# Altium schematic sheet Interface.SchDoc
size Legal
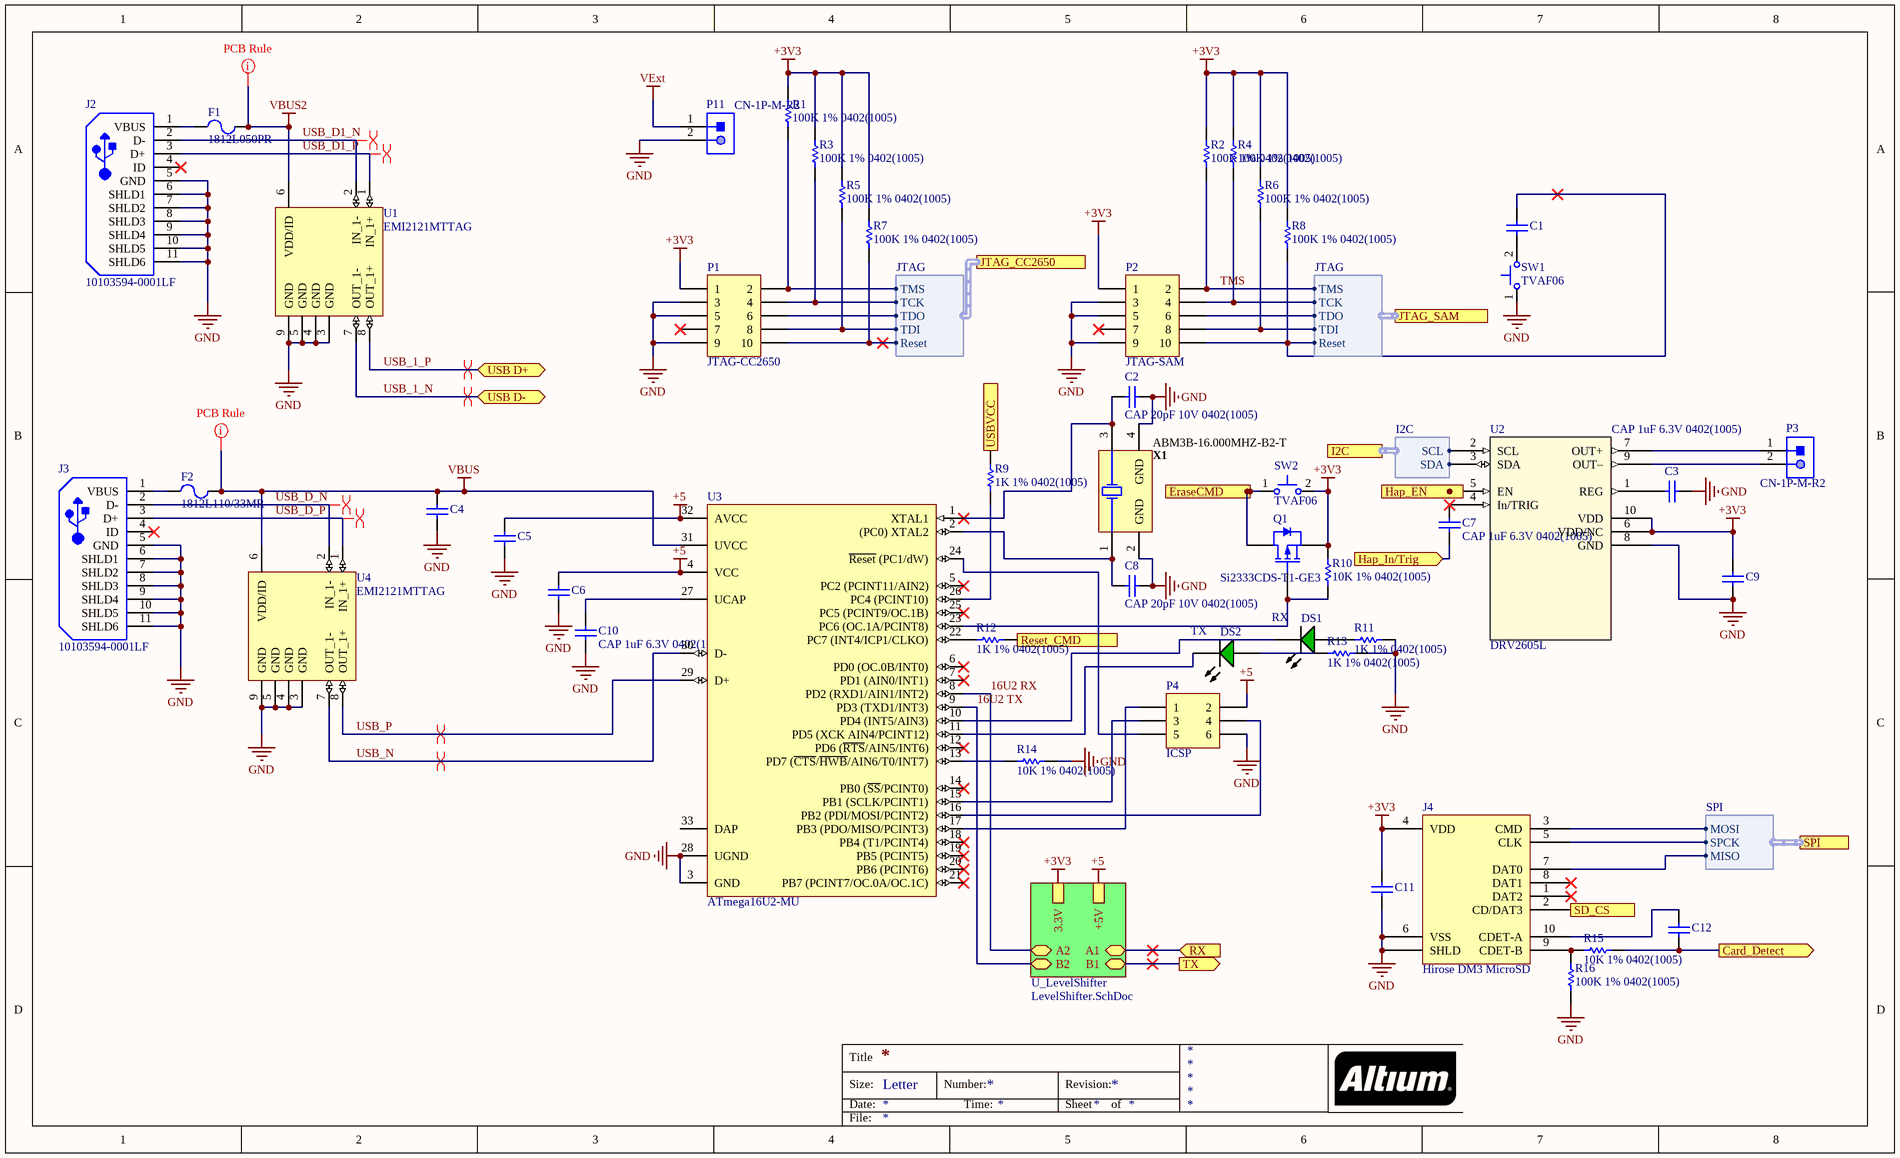
[diagram p0: Interface.SchDoc]

## Parts
C1  CAP 100nF 10V 0402(1005)  [CAPC0402(1005)60_L]  (value not drawn)
C2  CAP 20pF 10V 0402(1005)  [CAPC0402(1005)60_L]
C3  CAP 1uF 6.3V 0402(1005)  [CAPC0402(1005)60_L]
C4  CAP 100nF 10V 0402(1005)  [CAPC0402(1005)60_L]  (value not drawn)
C5  CAP 100nF 10V 0402(1005)  [CAPC0402(1005)60_L]  (value not drawn)
C6  CAP 100nF 10V 0402(1005)  [CAPC0402(1005)60_L]  (value not drawn)
C7  CAP 1uF 6.3V 0402(1005)  [CAPC0402(1005)60_L]
C8  CAP 20pF 10V 0402(1005)  [CAPC0402(1005)60_L]
C9  CAP 100nF 10V 0402(1005)  [CAPC0402(1005)60_L]  (value not drawn)
C10  CAP 1uF 6.3V 0402(1005)  [CAPC0402(1005)60_L]
C11  CAP 100nF 10V 0402(1005)  [CAPC0402(1005)60_L]  (value not drawn)
C12  CAP 100nF 10V 0402(1005)  [CAPC0402(1005)60_L]  (value not drawn)
DS1  RX  [LTST-C190GKT_V]
DS2  TX  [LTST-C190GKT_V]
F1  1812L050PR  [LFUS-1812L050_V]
F2  1812L110/33MR  [LFUS-1812L11033MR_V]
J2  10103594-0001LF  [FCI-10103594-0001LF_V]
J3  10103594-0001LF  [FCI-10103594-0001LF_V]
J4  Hirose DM3 MicroSD  [HIROSE DM3AT-SF-PEJM5]
P1  JTAG-CC2650  [MHDR2X5]
P2  JTAG-SAM  [MHDR2X5]
P3  CN-1P-M-R2  [B2B-PH-K-S]
P4  ICSP  [MHDR2X3]
P11  CN-1P-M-R2  [B2B-PH-K-S]
Q1  Si2333CDS-T1-GE3  [DIOD-SOT23-3_V]
R1  100K 1% 0402(1005)  [RESC0402(1005)_L]
R2  100K 1% 0402(1005)  [RESC0402(1005)_L]
R3  100K 1% 0402(1005)  [RESC0402(1005)_L]
R4  100K 1% 0402(1005)  [RESC0402(1005)_L]
R5  100K 1% 0402(1005)  [RESC0402(1005)_L]
R6  100K 1% 0402(1005)  [RESC0402(1005)_L]
R7  100K 1% 0402(1005)  [RESC0402(1005)_L]
R8  100K 1% 0402(1005)  [RESC0402(1005)_L]
R9  1K 1% 0402(1005)  [RESC0402(1005)_L]
R10  10K 1% 0402(1005)  [RESC0402(1005)_L]
R11  1K 1% 0402(1005)  [RESC0402(1005)_L]
R12  1K 1% 0402(1005)  [RESC0402(1005)_L]
R13  1K 1% 0402(1005)  [RESC0402(1005)_L]
R14  10K 1% 0402(1005)  [RESC0402(1005)_L]
R15  10K 1% 0402(1005)  [RESC0402(1005)_L]
R16  100K 1% 0402(1005)  [RESC0402(1005)_L]
SW1  TVAF06  [JNFU-TVAF06_V]
SW2  TVAF06  [JNFU-TVAF06_V]
U1  EMI2121MTTAG  [ONSC-WDFN-8-511BN_V]
U2  DRV2605L  [TSSOP50P490X110-10N]
U3  ATmega16U2-MU  [32PG_N]
U4  EMI2121MTTAG  [ONSC-WDFN-8-511BN_V]
X1  ABM3B-16.000MHZ-B2-T  [ABRA-ABM3B-4_V]

## Sub-sheets
U_LevelShifter = LevelShifter.SchDoc: 3.3V, A1 (bidir), A2 (bidir), +5V, B2 (bidir), B1 (bidir)

## Ports
Card_Detect (out), EraseCMD (out), Hap_EN (in), Hap_In/Trig (in), I2C (harness I2C), JTAG_CC2650 (harness JTAG), JTAG_SAM (harness JTAG), Reset_CMD (out), RX (in), SD_CS (in), SPI (harness SPI), TX (out), USB D+ (bidir), USB D- (bidir), USBVCC

## Harnesses
SPI: MISO, MOSI, SPCK
JTAG: TMS, TCK, TDO, TDI, Reset
I2C: SCL, SDA

## Nets
+3V3: C9.1 C11.2 J4.4(VDD) P1.1 P2.1 Q1.2(S) R1.2 R2.2 R3.2 R4.2 R5.2 R6.2 R7.2 R8.2 R10.2 SW2.2 U2.6(VDD/NC) U2.10(VDD) ; sheet U_LevelShifter/3.3V
+5: C5.1 C6.1 P4.2 U3.4(VCC) U3.32(AVCC) ; sheet U_LevelShifter/+5V
GND: C2.2 C3.1 C4.2 C5.2 C6.2 C8.2 C9.2 C10.1 C11.1 J2.5(GND) J2.6(SHLD1) J2.7(SHLD2) J2.8(SHLD3) J2.9(SHLD4) J2.10(SHLD5) J2.11(SHLD6) J3.5(GND) J3.6(SHLD1) J3.7(SHLD2) J3.8(SHLD3) J3.9(SHLD4) J3.10(SHLD5) J3.11(SHLD6) J4.6(VSS) J4.S(SHLD) P1.3 P1.5 P1.9 P2.3 P2.5 P2.9 P4.6 P11.2 R11.2 R13.2 R14.2 R16.2 SW1.1 U1.3(GND) U1.4(GND) U1.5(GND) U1.9(GND) U2.8(GND) U3.3(GND) U3.28(UGND) U4.3(GND) U4.4(GND) U4.5(GND) U4.9(GND) X1.2(GND) X1.4(GND)
VBUS: C4.1 F2.2 U3.31(UVCC) U4.6(VDD/ID)
VBUS2: F1.2 U1.6(VDD/ID)
VExt: P11.1
16U2 RX: U3.8(PD2_(RXD1/AIN1/INT2)) ; sheet U_LevelShifter/A2
16U2 TX: U3.9(PD3_(TXD1/INT3)) ; sheet U_LevelShifter/B2
Card_Detect: C12.1 R15.2 ; port Card_Detect
EraseCMD: Q1.3(D) SW2.1 ; port EraseCMD
Hap_In/Trig: C7.2 ; port Hap_In/Trig
Reset_CMD: R12.2 ; port Reset_CMD
RX: port RX, sheet U_LevelShifter/A1
SD_CS: J4.2(CD/DAT3) ; port SD_CS
TMS: P2.2 R2.1 ; port JTAG_SAM.TMS
TX: port TX, sheet U_LevelShifter/B1
USB_1_N: U1.7(OUT_1-) ; port USB D-
USB_1_P: U1.8(OUT_1+) ; port USB D+
USB_D1_N: J2.2(D-) U1.2(IN_1-)
USB_D1_P: J2.3(D+) U1.1(IN_1+)
USB_D_N: J3.2(D-) U4.2(IN_1-)
USB_D_P: J3.3(D+) U4.1(IN_1+)
USB_N: U3.30(D-) U4.7(OUT_1-)
USB_P: U3.29(D+) U4.8(OUT_1+)
USBVCC: R9.2 ; port USBVCC
NetC1_1: C1.1 SW1.2
NetC1_2: C1.2 P2.10 R8.1 ; port JTAG_SAM.Reset
NetC2_1: C2.1 U3.1(XTAL1) X1.3(X2)
NetC3_2: C3.2 U2.1(REG)
NetC7_1: C7.1 U2.4(In/TRIG)
NetC8_1: C8.1 U3.2((PC0)_XTAL2) X1.1(X1)
NetC10_2: C10.2 U3.27(UCAP)
NetC12_2: C12.2 J4.10(CDET-A)
NetDS1_1: DS1.1(A) R11.1
NetDS1_2: DS1.2(K) U3.10(PD4_(INT5/AIN3))
NetDS2_1: DS2.1(A) R13.1
NetDS2_2: DS2.2(K) U3.11(PD5_(XCK_AIN4/PCINT12))
NetF1_1: F1.1 J2.1(VBUS)
NetF2_1: F2.1 J3.1(VBUS)
NetJ4_3: J4.3(CMD) ; port SPI.MOSI
NetJ4_5: J4.5(CLK) ; port SPI.SPCK
NetJ4_7: J4.7(DAT0) ; port SPI.MISO
NetJ4_9: J4.9(CDET-B) R15.1 R16.1
NetP1_2: P1.2 R1.1 ; port JTAG_CC2650.TMS
NetP1_4: P1.4 R3.1 ; port JTAG_CC2650.TCK
NetP1_6: P1.6 ; port JTAG_CC2650.TDO
NetP1_8: P1.8 R5.1 ; port JTAG_CC2650.TDI
NetP1_10: P1.10 R7.1 ; port JTAG_CC2650.Reset
NetP2_4: P2.4 R4.1 ; port JTAG_SAM.TCK
NetP2_6: P2.6 ; port JTAG_SAM.TDO
NetP2_8: P2.8 R6.1 ; port JTAG_SAM.TDI
NetP3_1: P3.1 U2.7(OUT+)
NetP3_2: P3.2 U2.9(OUT–)
NetP4_1: P4.1 U3.17(PB3_(PDO/MISO/PCINT3))
NetP4_3: P4.3 U3.15(PB1_(SCLK/PCINT1))
NetP4_4: P4.4 U3.16(PB2_(PDI/MOSI/PCINT2))
NetP4_5: P4.5 U3.24(~{Reset}_(PC1/dW))
NetQ1_1: Q1.1(G) R10.1 U3.23(PC6_(OC.1A/PCINT8))
NetR9_1: R9.1 U3.26(PC4_(PCINT10))
NetR12_1: R12.1 U3.22(PC7_(INT4/ICP1/CLKO))
NetR14_1: R14.1 U3.13(PD7_(~{CTS}/~{HWB}/AIN6/T0/INT7))
NetU2_2: U2.2(SCL) ; port I2C.SCL
NetU2_3: U2.3(SDA) ; port I2C.SDA

Not connected (* = marked no-connect by the designer): J2 4(ID)*; J3 4(ID)*; J4 1(DAT2)* 8(DAT1)*; P1 7*; P2 7*; U2 5(EN); U3 5(PC2_(PCINT11/AIN2))* 6(PD0_(OC.0B/INT0))* 7(PD1_(AIN0/INT1))* 12(PD6_(~{RTS}/AIN5/INT6))* 14(PB0_(~{SS}/PCINT0))* 18(PB4_(T1/PCINT4))* 19(PB5_(PCINT5))* 20(PB6_(PCINT6))* 21(PB7_(PCINT7/OC.0A/OC.1C))* 25(PC5_(PCINT9/OC.1B))* 33(DAP)

## Layout directives
differential pair: USB_1_N, USB_1_P, USB_D1_N, USB_D1_P, USB_D_N, USB_D_P, USB_N, USB_P
rule Undefined: VBUS, VBUS2

## Notes on the sheet
- Title
- Size:
- Date:
- Letter
- Number:
- Time:
- Revision:
- Sheet
- of
- File:

## Library data of the parts
C1 C4-C6 C9 C11 C12 = CMP-1034-02066-1: CAP 100nF 10V ±20% 0402 (1005 Metric) Thickness 0.6mm SMD; Tolerance: Â±20%; Case-Metric: 1005; Case-EIA: 0402; Max Thickness: 0.6 mm; Rated Voltage: 10 V; Technology: SMT; Value: 100nF
C2 C8 = CMP-1034-00874-1: CAP 20pF 10V ±5% 0402 (1005 Metric) Thickness 0.6mm SMD; Case-EIA: 0402; Tolerance: Â±5%; Case-Metric: 1005; Value: 20pF; Rated Voltage: 10 V; Technology: SMT; Max Thickness: 0.6 mm
C3 C7 C10 = CMP-1034-02115-1: CAP 1uF 6.3V -20% to +80% 0402 (1005 Metric) Thickness 0.6mm SMD; Case-Metric: 1005; Case-EIA: 0402; Value: 1uF; Tolerance: -20% to +80%; Rated Voltage: 6.3 V; Max Thickness: 0.6 mm; Technology: SMT
DS1 DS2 = CMP-1674-00007-1: LED Uni-Color Green, 100 mW, 5 V, -55 to 85 degC, 2-Pin SMD, RoHS, Tape and Reel; ComponentLink2Description: Datasheet; ComponentLink2URL: http://datasheet.octopart.com/LTST-C190GKT-Lite-On-datasheet-158530.pdf; ComponentLink1Description: Manufacturer URL; PackageReference: C190GKT; PackageDescription: 2-Pin Surface Mount Device, Body 1.6 x 0.8 mm; ComponentLink1URL: http://www.us.liteon.com/; DatasheetVersion: Dec-06
F1 = CMP-1700-00002-1: POLY-FUSE(R) Resettable PTC, 0.5 A, 0.15 to 1 Ohm Resistance, -40 to 85 degC, 1812 (4532 Metric), RoHS, Tape and Reel; Voltage Rating: 50 V; Power Rating: 100 mW; Resistance: 150 kohm; Tolerance: 1%; Case\Package: 0603; ComponentLink2URL: http://www.littelfuse.com/~/media/electronics/datasheets/resettable_ptcs/littelfuse_ptc_1812l_datasheet.pdf.pdf; Pins: 2; Mount: Surface Mount; Width: 0.8 mm; Length: 1.6 mm; Package Quantity: 1; Max Operating Temperature: 155 degC; Case Code (Imperial): 0603; ComponentLink1Description: Manufacturer URL; PackageReference: 1812; ComponentLink1URL: http://www.littelfuse.com/; RoHSCompliant: true; Voltage Rating (DC): 50 V; Packaging: Tape and Reel; PackageDescription: 2-Pin Surface Mount Device, Body 4.55 x 3.24 mm; Min Operating Temperature: -55 degC; DatasheetVersion: Feb-16; REACH SVHC: No SVHC; Case Code (Metric): 1608; ComponentLink2Description: Datasheet; Height: 0.45 mm
F2 = CMP-1700-00004-1: Poly-Fuse (R) Resettable PTC, 0.8 W, 20 A, -40 to 85 degC, 2-Pin SMD, RoHS, Tape and Reel; Voltage Rating (DC): 100 V; Capacitance: 100 uF; Tolerance: 20%; Case\Package: Radial; Voltage Rating: 100 V; Packaging: Bulk; Max Operating Temperature: 85 degC; Length: 16 mm; ComponentLink1Description: Manufacturer URL; PackageReference: 1812L110/33MR; Pins: 2; PackageDescription: 2-Pin Surface Mount Device, Body 4.55 x 3.24 mm; ComponentLink2URL: http://www.littelfuse.com/~/media/electronics/datasheets/resettable_ptcs/littelfuse_ptc_1812l_datasheet.pdf.pdf; ComponentLink2Description: Datasheet; DatasheetVersion: Feb-16; Mount: Through Hole; Diameter: 10 mm; ComponentLink1URL: http://www.littelfuse.com/; Lead Pitch: 5 mm; Height: 16 mm; Package Quantity: 200; Radiation Hardening: No; RoHSCompliant: true; REACH SVHC: No SVHC; Min Operating Temperature: -40 degC
J2 J3 = CMP-1698-00007-1: Micro USB 2.0 B Receptacle, -55 to 85 degC, 5-Pin SMD, RoHS, Tape and Reel; Type (Resistor): Thick Film; Case\Package: 0603; Resistance: 4.7 kohm; Tolerance: 1%; Voltage Rating: 75 V; Power Rating: 100 mW; Case Code (Imperial): 0603; Case Code (Metric): 1608; REACH SVHC: Unknown; ComponentLink1URL: http://portal.fciconnect.com/; Package Quantity: 5000; RoHSCompliant: true; Max Operating Temperature: 155 degC; Min Operating Temperature: -55 degC; Mount: Surface Mount; Weight: 7.1E-05 oz; Length: 1.55 mm; PackageDescription: 5-Pin Surface Mount Device, Body 8.04 x 5.62 mm; Pins: 2; Height: 0.45 mm; ComponentLink2Description: Datasheet; ComponentLink2URL: http://portal.fciconnect.com/Comergent//fci/drawing/10103594.pdf; PackageReference: FCI-10103594-0001LF; DatasheetVersion: Rev. A, 06/2010; Width: 0.85 mm; Packaging: Tape and Reel; ComponentLink1Description: Manufacturer URL
P1 P2 = MHDR2X5: Header, 5-Pin, Dual row; LatestRevisionDate: 17-Jul-2002; LatestRevisionNote: Re-released for DXP Platform.; Publisher: Altium Limited
P4 = Header 3X2: Header, 3-Pin, Dual row; LatestRevisionDate: 17-Jul-2002; LatestRevisionNote: Re-released for DXP Platform.; Publisher: Altium Limited
Q1 = CMP-00020-0000-A.2: MOSFET 12V 5.1A 2.5W 35 mohms @ 4.5V; Manufacturer: Vishay; Channel Mode: Enhancement; Brand: Vishay Semiconductors; Rise Time: 35 ns; Transistor Polarity: P-Channel; Vgs - Gate-Source Voltage: 8 V; Number of Channels: 1 Channel; Pd - Power Dissipation: 1.25 W; Configuration: Single; Typical Turn-Off Delay Time: 45 ns; Transistor Type: 1 P-Channel; Vds - Drain-Source Breakdown Voltage: - 12 V; Typical Turn-On Delay Time: 13 ns; Tradename: TrenchFET; Standard Pack Qty: 3000; Reeling: True; Supplier Part Number: 781-SI2333CDS-T1-GE3; Series: SI2; Length: 3.04 mm; ComponentLink1URL: http://www.mouser.com/ds/2/427/si2333cd-244460.pdf; RoHS - Mouser: Y; Technology: Si; Width: 1.4 mm; Maximum Operating Temperature: + 150 C; Rds On - Drain-Source Resistance: 35 mOhms; Product: MOSFET Small Signal; Manufacturer Part Number: Si2333CDS-T1-GE3; Minimum Operating Temperature: - 55 C; Minimum Order Quantity: 1; Height: 1.02 mm; Supplier: Mouser; ComponentLink1Description: si2333cd-244460.pdf; Id - Continuous Drain Current: 5.1 A; Fall Time: 35 ns; Mounting Style: SMD/SMT; Package / Case: SOT-23-3; Packaging: Reel
R1-R8 R16 = CMP-1011-00736-1: 100K 0.063W 1% 0402 (1005 Metric)  SMD; Value: 100000.00 Ohm; Case-Metric: 1005; Case-EIA: 0402; Power: 0.063 W; Tolerance: 1 %; Technology: SMT
R9 R11-R13 = CMP-1011-00510-1: 1K 0.063W 1% 0402 (1005 Metric)  SMD; Case-EIA: 0402; Case-Metric: 1005; Value: 1000.00 Ohm; Technology: SMT; Tolerance: 1 %; Power: 0.063 W
R10 R14 R15 = CMP-1011-00623-1: 10K 0.063W 1% 0402 (1005 Metric)  SMD; Case-EIA: 0402; Value: 10000.00 Ohm; Case-Metric: 1005; Technology: SMT; Tolerance: 1 %; Power: 0.063 W
SW1 SW2 = CMP-0587-00001-2: Switch, SPST Push Button, 50 mA, 12 V DC, SMD, -30 to 85 degC, RoHS; Manufacturer: Jianfu; Contact Resistance: 100 mW max; Lifetime: 100000 Cycles min; Rating: 50 mA. 12 V DC; Insulation Resistance: 100 MW min. 100 V DC; Travel: 0.13 +/- 0.05 mm; Dielectric Strength: 250 V AC for 1 min; RoHS: TRUE; Mounting Technology: Surface Mount; PartNumber: TVAF06; PackageDescription: 2-Pin Switch, Push Button, SMD, Body 2.9 x 3.9 mm; ComponentLink1Description: Manufacturer URL; ComponentLink1URL: http://www.jian-fu.com/; Operating Temperature: -30 to 85 degC; ComponentLink2URL: http://en.jian-fu.com/product-22.html; PackageReference: TVAF06; ComponentLink2Description: Datasheet
U1 U4 = CMP-1066-00065-1: Single Pair Common Mode Filter with ESD Protection, -40 to 85 degC, 8-Pin WDFN, Pb-Free, Tape and Reel; Manufacturer: On Semiconductor; C Typ (pF): 0.8; Number of Lines: 3; VRWM Max (V): 5; ComponentLink2Description: Datasheet; PackageReference: WDFN-8-511BN; RoHS: Pb-Free; ComponentLink1Description: Manufacturer URL; PartNumber: EMI2121MTTAG; DatasheetVersion: Rev. 2; PackageVersion: Rev. A, 12/2012; PackageDescription: 8-Pin Small Outline No-Lead, Body 2.2 x 2 mm, Pitch 0.5 mm; Mounting Technology: Surface Mount; ComponentLink1URL: http://www.onsemi.com/; ComponentLink2URL: http://www.onsemi.com/pub_link/Collateral/EMI2121MT-D.PDF; Packing: Tape and Reel; ComponentLink3Description: Package Specification; ComponentLink3URL: http://www.onsemi.com/pub_link/Collateral/511BN.PDF
U2 = DRV2605L: 2 to 5.2 V Haptic Driver for LRA and ERM  With Effect Library and Smart-Loop Architecture
U3 = CMP-0095-00115-3: 8-bit AVR Microcontroller, 2.7-5.5V, 16KB Flash, 512 Bytes EEPROM, 512 Bytes SRAM, 32-pin VQFN, Industrial Grade (-40°C to 85°C); ComponentLink1Description: Manufacturer URL; RevisionNote: Schematic symbol corrected; ComponentLink3URL: http://www.atmel.com/dyn/resources/prod_documents/7799S.pdf; ComponentLink2URL: http://www.atmel.com/dyn/resources/prod_documents/doc7799.pdf; PackageReference: 32PG; DatasheetVersion: revD, Nov-2010; PartNumber: ATmega16U2-MU; PackageVersion: revA, Oct-2008; Code_JEDEC: MO-220WHHD-2; PackageDescription: 32-Pin Quad Flat No-Lead (QFN) Sawn,  5 x 5 x 1.0 mm Body, Pitch 0.50 mm, 3.60mm Exposed Pad; ComponentLink2Description: ATmega8U2/16U2/32U2 Datasheet; ComponentLink1URL: http://www.atmel.com/; ComponentLink3Description: ATmega8U2/16U2/32U2 Summary
X1 = CMP-1688-00003-1: Ceramic SMD Crystal, 16 MHz, +/- 20 ppm, 50 Ohm, -20 to 70 degC, 4-Pin SMD, RoHS, Tape and Reel; Current Rating: 1.82 A; Resistance: 0.033 Ohm; Tolerance: 30%; Shielding: Shielded; REACH SVHC: Unknown; RoHSCompliant: True; PackageReference: ABM3B; Mount: Surface Mount; Max Operating Temperature: 105degC; DatasheetVersion: Aug-15; Package Quantity: 500; PackageDescription: 4-Pin Surface Mount Device, Body 5 x 3.2 mm; ComponentLink2URL: http://www.abracon.com/Resonators/abm3b.pdf; Packaging: Tape and Reel; Height: 2.8 mm; ComponentLink1URL: http://www.abracon.com/; ComponentLink2Description: Datasheet; Length: 0.197 inch; ComponentLink1Description: Manufacturer URL; Case/Package: 5028; Width: 0.197 inch; Min Operating Temperature: -40degC